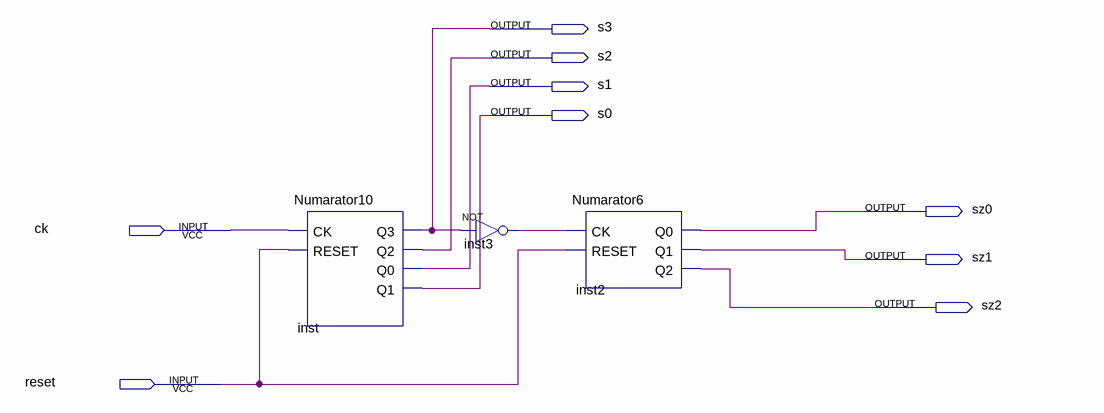
[diagram p0: schematic sheet]
// Quartus schematic numSec.bdf as structural Verilog: 3 symbols, 9 pins
module numSec (
  input  ck,
  input  reset,
  output s3,
  output s2,
  output s1,
  output s0,
  output sz0,
  output sz1,
  output sz2
);

  wire inst3_out;

  Numarator10 inst (.CK(ck), .RESET(reset), .Q3(s3), .Q2(s2), .Q0(s1), .Q1(s0));
  not inst3 (inst3_out, s3);
  Numarator6 inst2 (.CK(inst3_out), .RESET(reset), .Q0(sz0), .Q1(sz1), .Q2(sz2));
endmodule
